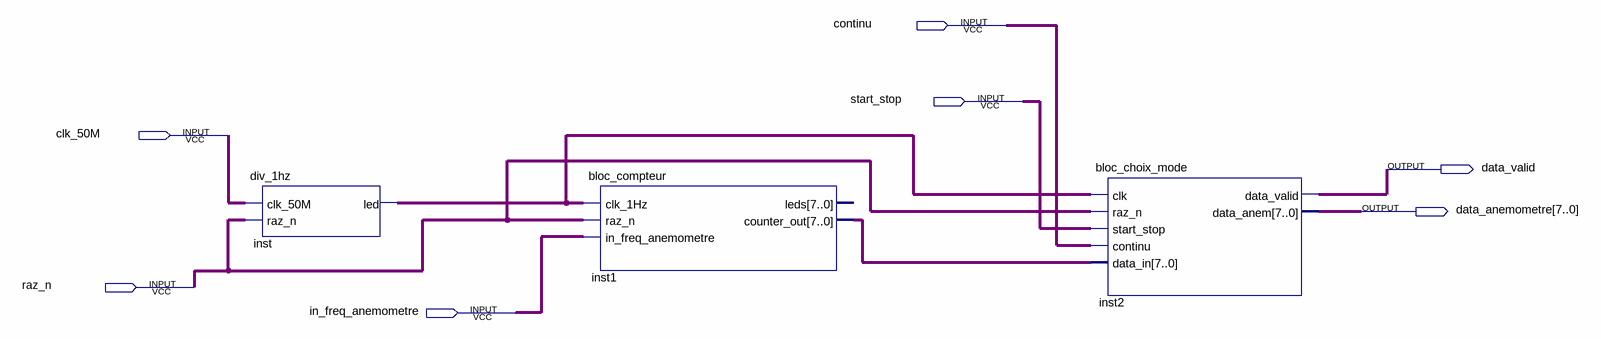
[diagram p0: schematic sheet]
// Quartus schematic bloc_gestion_anemometre.bdf as structural Verilog: 3 symbols, 7 pins
module bloc_gestion_anemometre (
  input  continu,
  input  start_stop,
  input  clk_50M,
  input  raz_n,
  input  in_freq_anemometre,
  output data_valid,
  output [7:0] data_anemometre
);

  wire inst_led;
  wire [7:0] inst1_counter_out;

  div_1hz inst (.clk_50M(clk_50M), .raz_n(raz_n), .led(inst_led));
  bloc_compteur inst1 (
    .clk_1Hz(inst_led), .raz_n(raz_n), .in_freq_anemometre(in_freq_anemometre),
    .counter_out(inst1_counter_out));  // open: leds
  bloc_choix_mode inst2 (
    .clk(inst_led), .raz_n(raz_n), .start_stop(start_stop), .continu(continu), .data_in(inst1_counter_out),
    .data_valid(data_valid), .data_anem(data_anemometre));
endmodule
